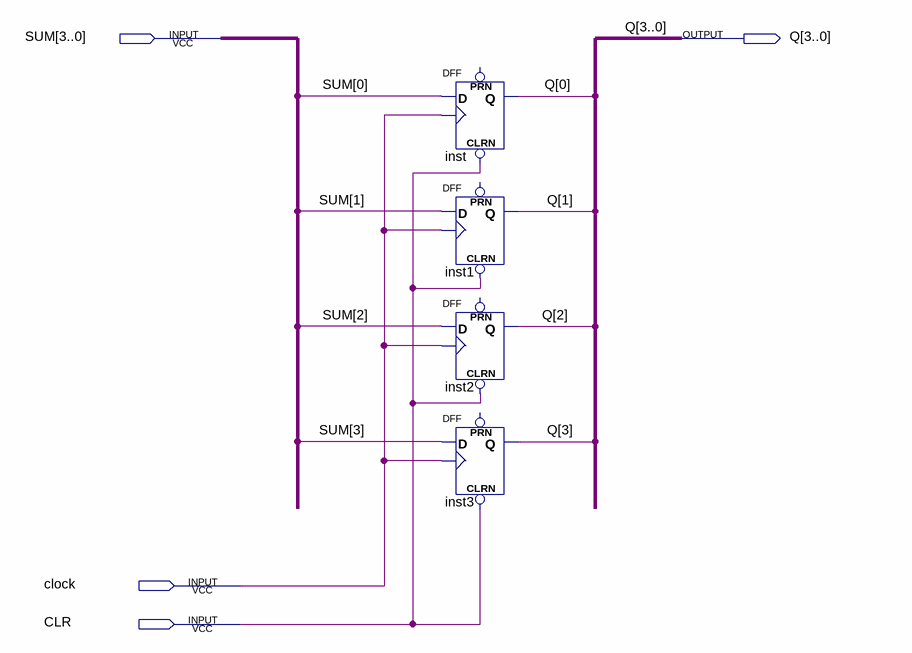
[diagram p0: schematic sheet]
// Quartus schematic Storage.bdf as structural Verilog: 4 symbols, 4 pins
module Storage (
  input  [3:0] SUM,
  input  clock,
  input  CLR,
  output [3:0] Q
);

  DFF inst (.CLRN(CLR), .CLK(clock), .D(SUM[0]), .Q(Q[0]));  // open: PRN
  DFF inst1 (.CLRN(CLR), .CLK(clock), .D(SUM[1]), .Q(Q[1]));  // open: PRN
  DFF inst2 (.CLRN(CLR), .CLK(clock), .D(SUM[2]), .Q(Q[2]));  // open: PRN
  DFF inst3 (.CLRN(CLR), .CLK(clock), .D(SUM[3]), .Q(Q[3]));  // open: PRN
endmodule
